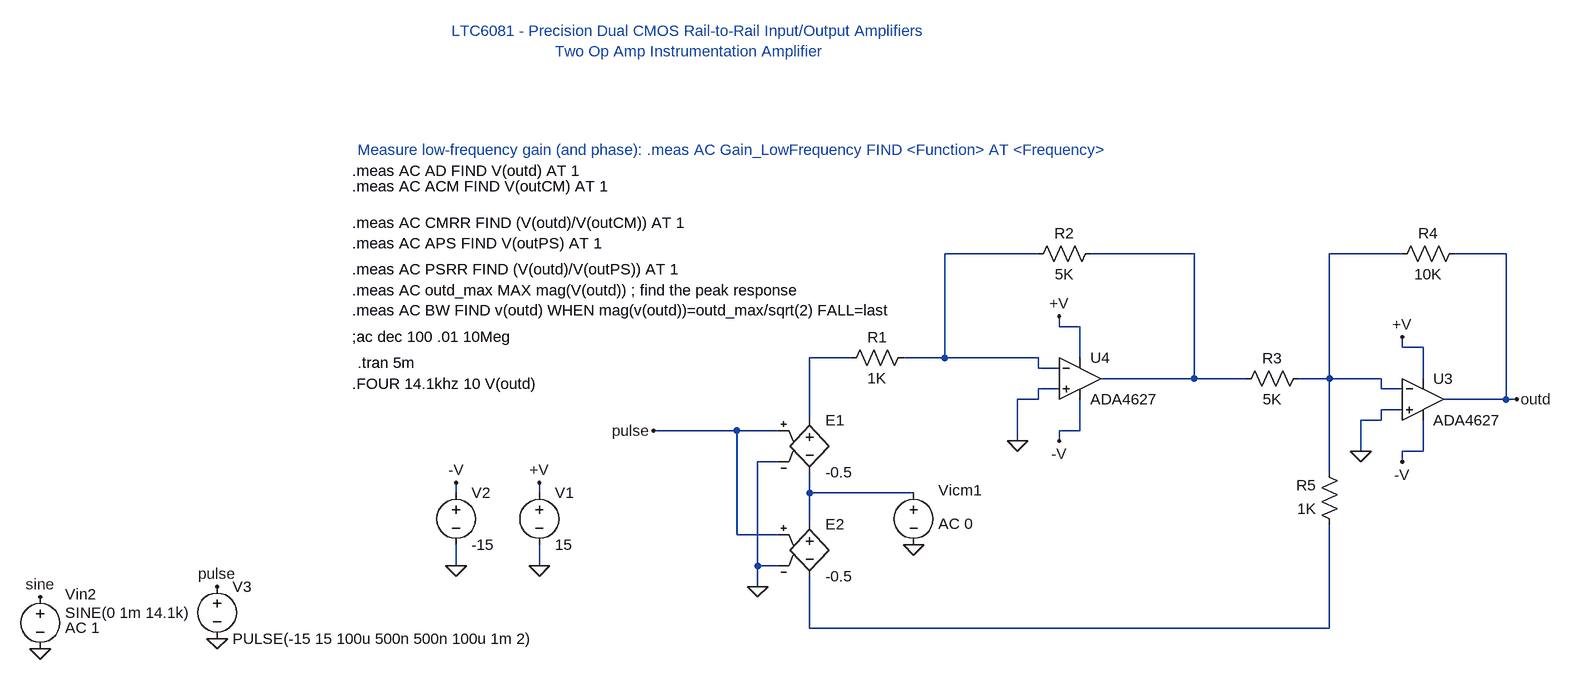
[diagram p0: schematic Etaj1-Laborator TRAN.asc]
Etaj1-Laborator TRAN.asc, the LTspice schematic file:
Version 4
SHEET 1 1248 2108
WIRE 96 48 -48 48
WIRE 336 48 176 48
WIRE 656 48 544 48
WIRE 816 48 736 48
WIRE 128 160 128 144
WIRE 160 160 128 160
WIRE 656 192 656 176
WIRE 688 192 656 192
WIRE -192 208 -256 208
WIRE -48 208 -48 48
WIRE -48 208 -112 208
WIRE 96 208 -48 208
WIRE 160 208 160 160
WIRE 96 224 96 208
WIRE 128 224 96 224
WIRE 336 240 336 48
WIRE 336 240 192 240
WIRE 416 240 336 240
WIRE 544 240 544 48
WIRE 544 240 496 240
WIRE 624 240 544 240
WIRE 688 240 688 192
WIRE 128 256 96 256
WIRE 624 256 624 240
WIRE 656 256 624 256
WIRE 96 272 96 256
WIRE 96 272 64 272
WIRE 816 272 816 48
WIRE 816 272 720 272
WIRE 832 272 816 272
WIRE 656 288 624 288
WIRE -256 304 -256 208
WIRE 624 304 624 288
WIRE 624 304 592 304
WIRE -368 320 -496 320
WIRE -304 320 -368 320
WIRE 160 320 160 272
WIRE 160 320 128 320
WIRE 64 336 64 272
WIRE 128 336 128 320
WIRE 592 352 592 304
WIRE 688 352 688 304
WIRE 688 352 656 352
WIRE -304 368 -336 368
WIRE 656 368 656 352
WIRE 544 384 544 240
WIRE -800 416 -800 400
WIRE -672 416 -672 400
WIRE -256 416 -256 384
WIRE -96 416 -256 416
WIRE -256 464 -256 416
WIRE -368 480 -368 320
WIRE -304 480 -368 480
WIRE -800 528 -800 496
WIRE -672 528 -672 496
WIRE -336 528 -336 368
WIRE -304 528 -336 528
WIRE -336 560 -336 528
WIRE -256 624 -256 544
WIRE 544 624 544 464
WIRE 544 624 -256 624
FLAG -672 528 0
FLAG 128 144 +V
FLAG -672 400 +V
FLAG 128 336 -V
FLAG -800 528 0
FLAG -800 400 -V
FLAG 656 176 +V
FLAG 656 368 -V
FLAG 832 272 outd
FLAG 64 336 0
FLAG 592 352 0
FLAG -336 560 0
FLAG -96 496 0
FLAG -1168 640 0
FLAG -1440 576 sine
FLAG -1168 560 pulse
FLAG -1440 656 0
FLAG -496 320 pulse
SYMBOL voltage -672 400 R0
WINDOW 123 0 0 Left 2
WINDOW 39 0 0 Left 2
SYMATTR InstName V1
SYMATTR Value 15
SYMBOL voltage -800 400 R0
WINDOW 123 0 0 Left 2
WINDOW 39 0 0 Left 2
SYMATTR InstName V2
SYMATTR Value -15
SYMBOL res -96 192 R90
WINDOW 0 0 56 VBottom 2
WINDOW 3 32 56 VTop 2
SYMATTR InstName R1
SYMATTR Value 1K
SYMBOL res 192 32 R90
WINDOW 0 0 56 VBottom 2
WINDOW 3 32 56 VTop 2
SYMATTR InstName R2
SYMATTR Value 5K
SYMBOL res 512 224 R90
WINDOW 0 0 56 VBottom 2
WINDOW 3 32 56 VTop 2
SYMATTR InstName R3
SYMATTR Value 5K
SYMBOL res 752 32 R90
WINDOW 0 0 56 VBottom 2
WINDOW 3 32 56 VTop 2
SYMATTR InstName R4
SYMATTR Value 10K
SYMBOL res 560 480 R180
WINDOW 0 36 76 Left 2
WINDOW 3 36 40 Left 2
SYMATTR InstName R5
SYMATTR Value 1K
SYMBOL e -256 288 R0
SYMATTR InstName E1
SYMATTR Value -0.5
SYMBOL e -256 448 R0
SYMATTR InstName E2
SYMATTR Value -0.5
SYMBOL voltage -96 400 R0
WINDOW 123 38 63 Left 2
WINDOW 39 0 0 Left 2
WINDOW 0 38 12 Left 2
WINDOW 3 -188 38 Left 2
SYMATTR Value2 AC 0
SYMATTR InstName Vicm1
SYMATTR Value ""
SYMBOL OpAmps\\ADA4627 688 208 R0
SYMATTR InstName U3
SYMBOL OpAmps\\ADA4627 160 176 R0
SYMATTR InstName U4
SYMBOL voltage -1168 544 R0
WINDOW 123 0 0 Left 0
WINDOW 39 0 0 Left 0
SYMATTR InstName V3
SYMATTR Value PULSE(-15 15 100u 500n 500n 100u 1m 2)
SYMBOL voltage -1440 560 R0
WINDOW 123 38 63 Left 2
WINDOW 39 0 0 Left 2
WINDOW 0 38 12 Left 2
WINDOW 3 38 40 Left 2
SYMATTR Value2 AC 1
SYMATTR InstName Vin2
SYMATTR Value SINE(0 1m 14.1k)
TEXT -440 -248 Bottom 2 ;LTC6081 - Precision Dual CMOS Rail-to-Rail Input/Output Amplifiers\nTwo Op Amp Instrumentation Amplifier
TEXT -960 176 Left 2 !;ac dec 100 .01 10Meg
TEXT -960 -80 Left 2 !.meas AC AD FIND V(outd) AT 1
TEXT -952 -112 Left 2 ;Measure low-frequency gain (and phase): .meas AC Gain_LowFrequency FIND <Function> AT <Frequency>
TEXT -960 -56 Left 2 !.meas AC ACM FIND V(outCM) AT 1
TEXT -960 0 Left 2 !.meas AC CMRR FIND (V(outd)/V(outCM)) AT 1
TEXT -960 72 Left 2 !.meas AC PSRR FIND (V(outd)/V(outPS)) AT 1
TEXT -960 32 Left 2 !.meas AC APS FIND V(outPS) AT 1
TEXT -960 104 Left 2 !.meas AC outd_max MAX mag(V(outd)) ; find the peak response\n.meas AC BW FIND v(outd) WHEN mag(v(outd))=outd_max/sqrt(2) FALL=last
TEXT -952 216 Left 2 !.tran 5m
TEXT -960 248 Left 2 !.FOUR 14.1khz 10 V(outd)

The netlist it stands for:
* Etaj1-Laborator TRAN.asc
V1 +V 0 15
V2 -V 0 -15
R1 N001 N004 1K
R2 N002 N001 5K
R3 N003 N002 5K
R4 outd N003 10K
R5 N006 N003 1K
E1 N004 N005 pulse 0 -0.5
E2 N005 N006 pulse 0 -0.5
Vicm1 N005 0 AC 0
XU3 0 N003 +V -V outd ADA4627  ; pins In+ In- V+ V- OUT
XU4 0 N001 +V -V N002 ADA4627  ; pins In+ In- V+ V- OUT
V3 pulse 0 PULSE(-15 15 100u 500n 500n 100u 1m 2)
Vin2 sine 0 SINE(0 1m 14.1k) AC 1
* LTC6081 - Precision Dual CMOS Rail-to-Rail Input/Output Amplifiers
* Two Op Amp Instrumentation Amplifier
;ac dec 100 .01 10Meg
.meas AC AD FIND V(outd) AT 1
* Measure low-frequency gain (and phase): .meas AC Gain_LowFrequency FIND <Function> AT <Frequency>
.meas AC ACM FIND V(outCM) AT 1
.meas AC CMRR FIND (V(outd)/V(outCM)) AT 1
.meas AC PSRR FIND (V(outd)/V(outPS)) AT 1
.meas AC APS FIND V(outPS) AT 1
.meas AC outd_max MAX mag(V(outd)) ; find the peak response
.meas AC BW FIND v(outd) WHEN mag(v(outd))=outd_max/sqrt(2) FALL=last
.tran 5m
.FOUR 14.1khz 10 V(outd)
.backanno
.end